# Altium schematic sheet Config.SchDoc: FPGA Configuration
size A4; Engineer: Samer Kilani; DocumentNumber: 9; SheetNumber: 9; SheetTotal: 9
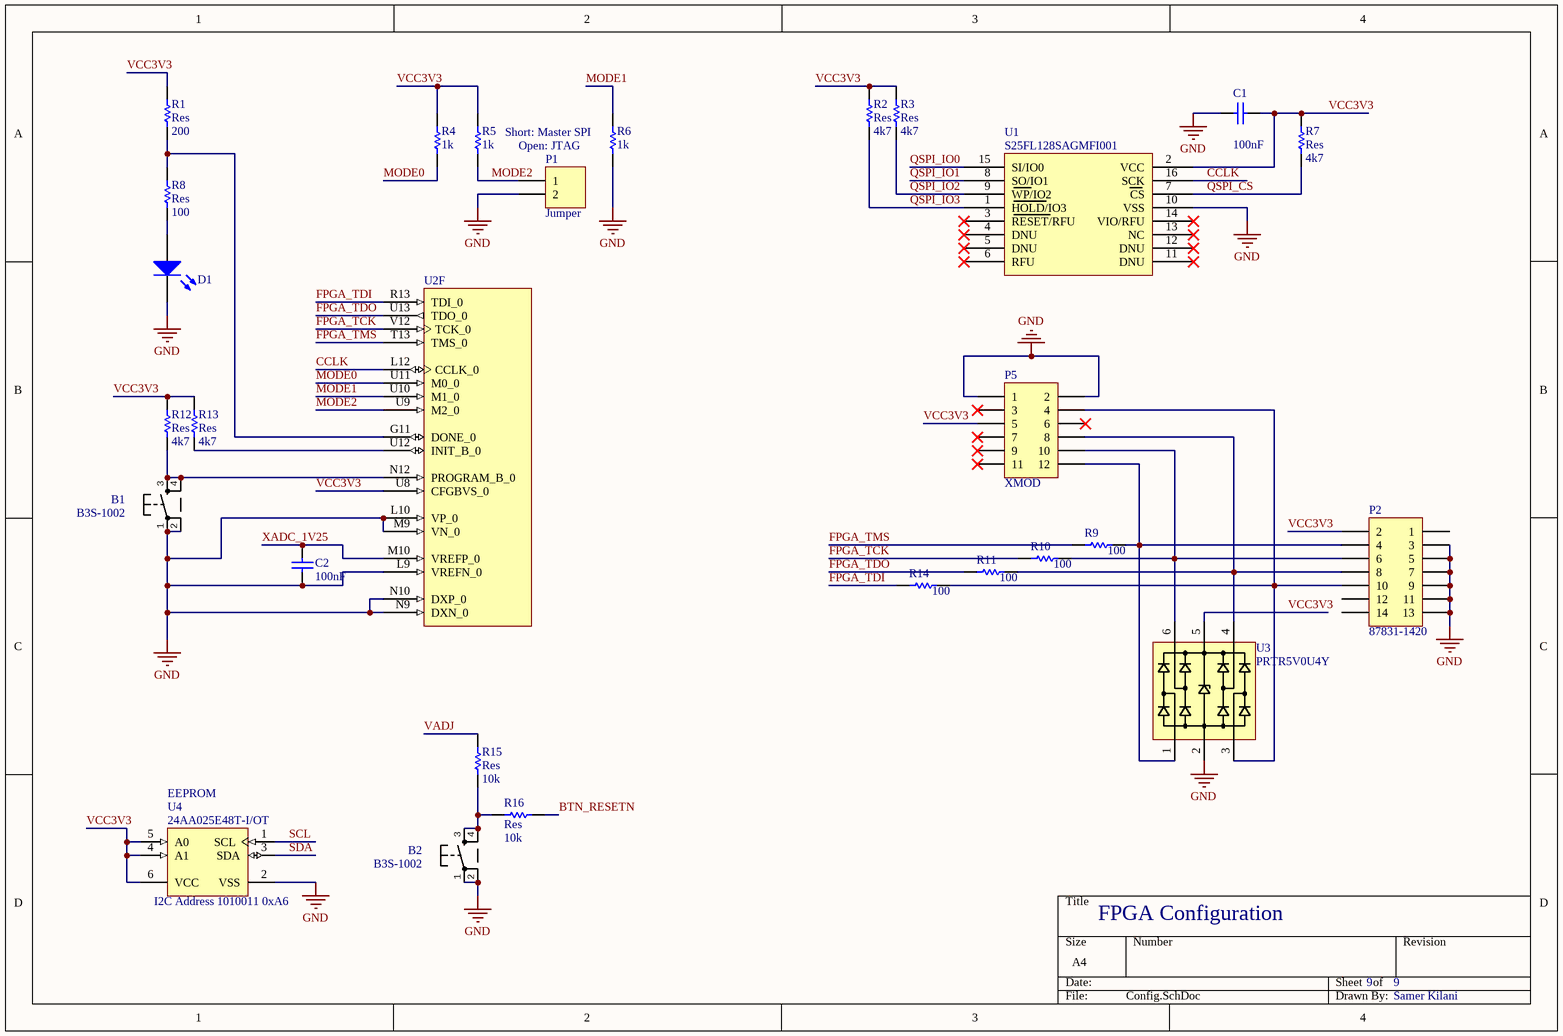
[diagram p0: Config.SchDoc]

## Parts
B1  B3S-1002  [B3S-1002]
B2  B3S-1002  [B3S-1002]
C1  value 100nF  [C0603]  (hidden comment: Cap)
C2  value 100nF  [C0402]  (hidden comment: Cap)
D1  KPT-1608EC  [KP-1608QBC-D]  (value not drawn)
P1  Jumper  [HDR1X2]
P2  87831-1420  [87831-1420]
P5  XMOD  [HDR2X6]
R1  Res  value 200  [R0603]
R2  Res  value 4k7  [R0603]
R3  Res  value 4k7  [R0603]
R4  value 1k  [R0402]  (hidden comment: Res)
R5  value 1k  [R0402]  (hidden comment: Res)
R6  value 1k  [R0402]  (hidden comment: Res)
R7  Res  value 4k7  [R0603]
R8  Res  value 100  [R0603]
R9  value 100  [R0402]  (hidden comment: Res)
R10  value 100  [R0402]  (hidden comment: Res)
R11  value 100  [R0402]  (hidden comment: Res)
R12  Res  value 4k7  [R0603]
R13  Res  value 4k7  [R0402]
R14  value 100  [R0402]  (hidden comment: Res)
R15  Res  value 10k  [R0603]
R16  Res  value 10k  [R0603]
U1  S25FL128SAGMFI001  [SOIC16]
U2  (no value)  [FGG484]  (part F of 12)
U3  PRTR5V0U4Y  [SOT363]
U4  24AA025E48T-I/OT  [MCHP-SOT-23-OT6_N]

## Nets
GND: B1.1 B1.2 B2.1 B2.2 C1.1 C2.1 D1.2(K) P1.2 P2.3 P2.5 P2.7 P2.9 P2.11 P2.13 P5.1 P5.2 R6.1 U1.10(VSS) U2.L9(VREFN_0) U2.L10(VP_0) U2.M9(VN_0) U2.N9(DXN_0) U2.N10(DXP_0) U3.2 U4.2(VSS)
BTN_RESETN: R16.1
CCLK: U1.16(SCK) U2.L12(CCLK_0)
FPGA_TCK: R10.1 U2.V12(TCK_0)
FPGA_TDI: R14.1 U2.R13(TDI_0)
FPGA_TDO: R11.1 U2.U13(TDO_0)
FPGA_TMS: R9.1 U2.T13(TMS_0)
MODE0: R4.1 U2.U11(M0_0)
MODE1: R6.2 U2.U10(M1_0)
MODE2: P1.1 R5.1 U2.U9(M2_0)
QSPI_CS: R7.1 U1.7(CS)
QSPI_IO0: U1.15(SI/IO0)
QSPI_IO1: U1.8(SO/IO1)
QSPI_IO2: R3.1 U1.9(WP/IO2)
QSPI_IO3: R2.1 U1.1(HOLD/IO3)
SCL: U4.1(SCL)
SDA: U4.3(SDA)
VADJ: R15.2
VCC3V3: C1.2 P2.2 P5.5 R1.2 R2.2 R3.2 R4.2 R5.2 R7.2 R12.2 R13.2 U1.2(VCC) U2.U8(CFGBVS_0) U3.5 U4.4(A1) U4.5(A0) U4.6(VCC)
XADC_1V25: C2.2 U2.M10(VREFP_0)
NetB1_3: B1.3 B1.4 R12.1 U2.N12(PROGRAM_B_0)
NetB2_3: B2.3 B2.4 R15.1 R16.2
NetD1_1: D1.1(A) R8.1
NetP2_4: P2.4 P5.12 R9.2 U3.1
NetP2_6: P2.6 P5.10 R10.2 U3.6
NetP2_8: P2.8 P5.8 R11.2 U3.4
NetP2_10: P2.10 P5.4 R14.2 U3.3
NetR1_1: R1.1 R8.2 U2.G11(DONE_0)
NetR13_1: R13.1 U2.U12(INIT_B_0)

Not connected (* = marked no-connect by the designer): P2 1 12 14; P5 3* 6* 7* 9* 11*; U1 3(RESET/RFU)* 4(DNU)* 5(DNU)* 6(RFU)* 11(DNU)* 12(DNU)* 13(NC)* 14(VIO/RFU)*

## Notes on the sheet
- (near R6) Short: Master SPI
- Open: JTAG
- (near U4) EEPROM
- (near U4) I2C Address 1010011 0xA6

## Library data of the parts
B1 B2 = TS42: PartNo: B3S-1002
C1 C2 = Cap: Capacitor; Published: 8-Jun-2000; LatestRevisionDate: 17-Jul-2002; LatestRevisionNote: Re-released for DXP Platform.; PackageReference: RAD-0.3; Publisher: Altium Limited; PackageDescription: Radial Cap, Thru-Hole; 2 Leads; 0.3 in Pin Spacing
D1 = LED: Published: 8-Jun-2000; LatestRevisionDate: 08-Jul-2005; LatestRevisionNote: Mech Layer 1 removed.; PackageReference: LED-0; Publisher: Altium Limited; PackageDescription: LED; 2 Leads
P1 = Header 2: Header, 2-Pin; LatestRevisionDate: 17-Jul-2002; LatestRevisionNote: Re-released for DXP Platform.; Publisher: Altium Limited
P2 = Header 7X2: Header, 7-Pin, Dual row; LatestRevisionDate: 17-Jul-2002; LatestRevisionNote: Re-released for DXP Platform.; Publisher: Altium Limited
P5 = Header 6X2: Header, 6-Pin, Dual row; LatestRevisionDate: 17-Jul-2002; LatestRevisionNote: Re-released for DXP Platform.; Publisher: Altium Limited
R1-R16 = Res: Resistor
U2 = XC7A35T-1FGG484C: Artix-7 FPGA, 250 User I/Os, 4 GTP, 484-Ball BGA, Speed Grade 1, Commercial Grade, Pb-Free; Manufacturer: Xilinx; Total Block RAM: 1800 Kb; GTP: 4; Clock Mgmt Tiles (CMTs): 5; Logic Cells: 33280; Available User I/O: 250; Speed Grades: 1; DatasheetVersion: v1.15; PackageVersion: Rev. 1.11; PackageReference: FGG484; PackageDescription: 484-Ball Wire-Bond Fine-Pitch BGA, Body 23 x 23 mm, Pitch 1 mm; Maximum Distributed RAM: 400 Kb; Operating Temperature Range: Commercial; NexusDeviceID: XC7A35T-1FGG484C; Mounting Technology: Surface Mount; PartNumber: XC7A35T-1FGG484C; ComponentLink1Description: Manufacturer URL; ComponentLink1URL: http://www.xilinx.com/; ComponentLink2Description: Datasheet; ComponentLink2URL: http://www.xilinx.com/support/documentation/data_sheets/ds180_7Series_Overview.pdf; ComponentLink3Description: Package Specification; ComponentLink3URL: http://www.xilinx.com/support/documentation/user_guides/ug475_7Series_Pkg_Pinout.pdf; ComponentLink4Description: DC and Switching Characteristics; ComponentLink4URL: http://www.xilinx.com/support/documentation/data_sheets/ds181_Artix_7_Data_Sheet.pdf; ComponentLink5Description: Package File; ComponentLink5URL: http://www.xilinx.com/support/packagefiles/a7packages/xc7a200tsbg484pkg.txt; ComponentLink6Description: Packaging and Pinout; ComponentLink6URL: http://www.xilinx.com/support/documentation/user_guides/ug475_7Series_Pkg_Pinout.pdf
U4 = 24AA025E48T-I/OT: 2K bits I2C™ Serial EEPROM with EUI-48™ Node Identity, 1.7 to 5.5 V, 400 kHz, -40 to 85 degC, 6-pin SOT-23 (OT6), Tape and Reel; Manufacturer: Microchip; DatasheetVersion: Rev. D; PackageVersion: C04-028B; PackageReference: SOT-23-OT6; PackageDescription: 6-Lead Plastic Small Outline Transistor, 2.9 x 1.55 mm Body, 0.95 mm Pitch; Supplier 1: Digi-Key; Supplier Part Number 1: 24AA025E48T-I/OTTR-ND; Supplier 2: Digi-Key; Supplier Part Number 2: 24AA025E48T-I/OTCT-ND; Supplier 3: Digi-Key; Supplier Part Number 3: 24AA025E48T-I/OTDKR-ND; Supplier 4: Farnell; Supplier Part Number 4: 1814891RL; Supplier 5: Farnell; Supplier Part Number 5: 1814891; Supplier 6: Newark; Supplier Part Number 6: 74R6951; Supplier 7: Newark; Supplier Part Number 7: 73R8708; Supplier 8: Mouser; Supplier Part Number 8: 579-24AA025E48T-I/OT; Mounting Technology: Surface Mount; PartNumber: 24AA025E48T-I/OT; ComponentLink1Description: Manufacturer URL; ComponentLink1URL: http://www.microchip.com; ComponentLink2Description: Datasheet; ComponentLink2URL: http://ww1.microchip.com/downloads/en/DeviceDoc/22124D.pdf; ComponentLink3Description: Package Specification; ComponentLink3URL: http://www.microchip.com/stellent/groups/techpub_sg/documents/packagingspec/en012702.pdf; ComponentLink4Description: Product URL; ComponentLink4URL: http://www.microchip.com/24AA025E48